# Altium project Core.PrjPcb
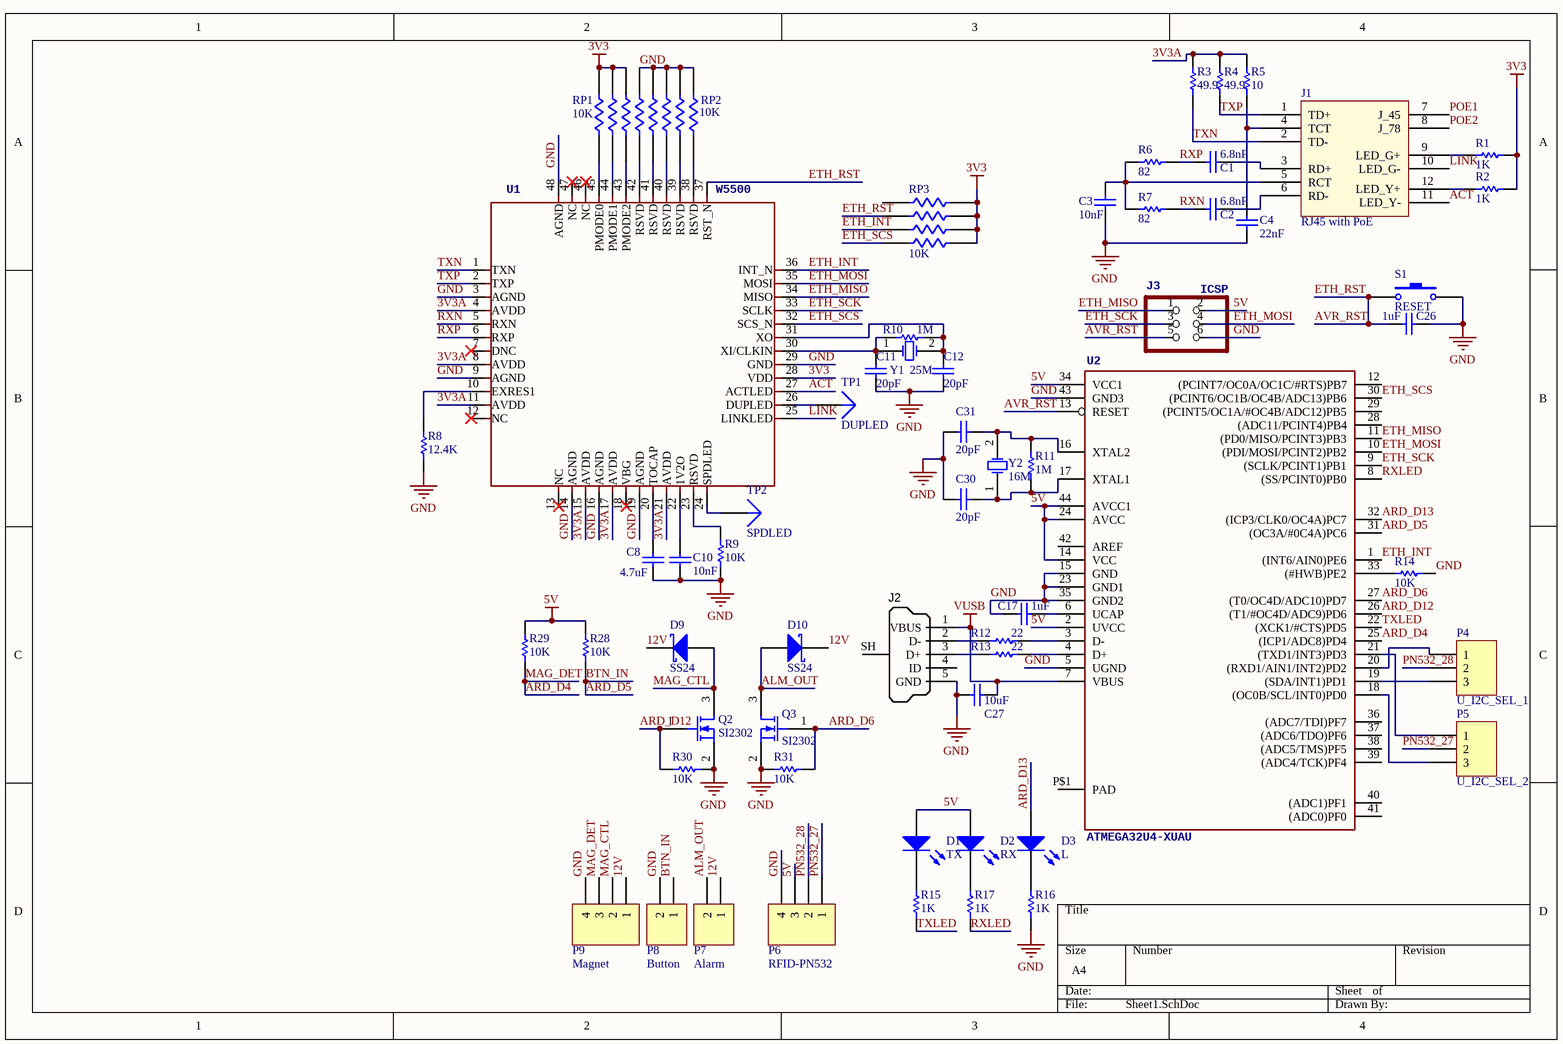
[diagram p0: Sheet1.SchDoc]
2 sheets, 112 parts. Net scope: global (net labels, ports and power ports of the same name join across sheets).
Board file: Core.PcbDoc
Sheets:
  Sheet1.SchDoc
  power.SchDoc

## Sheet Sheet1.SchDoc
size A4

### Parts
C1  value 6.8nF  [C-1608[0603]]  (hidden comment: Cap Semi)
C2  value 6.8nF  [C-1608[0603]]  (hidden comment: Cap Semi)
C3  value 10nF  [C-1608[0603]]  (hidden comment: Cap Semi)
C4  value 22nF  [C-1608[0603]]  (hidden comment: Cap Semi)
C8  value 4.7uF  [C-1608[0603]]  (hidden comment: Cap Semi)
C10  value 10nF  [C-1608[0603]]  (hidden comment: Cap Semi)
C11  value 20pF  [C-1608[0603]]  (hidden comment: Cap Semi)
C12  value 20pF  [C-1608[0603]]  (hidden comment: Cap Semi)
C17  value 1uF  [C-1608[0603]]  (hidden comment: Cap Semi)
C26  value 1uF  [C-1608[0603]]  (hidden comment: Cap Semi)
C27  value 10uF  [C-1608[0603]]  (hidden comment: Cap Semi)
C30  value 20pF  [C-1608[0603]]  (hidden comment: Cap Semi)
C31  value 20pF  [C-1608[0603]]  (hidden comment: Cap Semi)
D1  TX  [LED-1608[0603]-R]
D2  RX  [LED-1608[0603]-R]
D3  L  [LED-1608[0603]-R]
D9  SS24  [DO-214AC]
D10  SS24  [DO-214AC]
J1  RJ45 with PoE  [HR911105A]
J2  USB Micro Type B  [MICRO USB 3D]  (value not drawn)
J3  ICSP  [HDR2X3]
P4  U_I2C_SEL_1  [shortPad]
P5  U_I2C_SEL_2  [shortPad]
P6  RFID-PN532  [HDR1X4H]
P7  Alarm  [HDR1X2H]
P8  Button  [HDR1X2H]
P9  Magnet  [HDR1X4H]
Q2  SI2302  [SOT23B]
Q3  SI2302  [SOT23B]
R1  value 1K  [R-1608[0603]]  (hidden comment: Res Semi)
R2  value 1K  [R-1608[0603]]  (hidden comment: Res Semi)
R3  value 49.9  [R-1608[0603]]  (hidden comment: Res Semi)
R4  value 49.9  [R-1608[0603]]  (hidden comment: Res Semi)
R5  value 10  [R-1608[0603]]  (hidden comment: Res Semi)
R6  value 82  [R-1608[0603]]  (hidden comment: Res Semi)
R7  value 82  [R-1608[0603]]  (hidden comment: Res Semi)
R8  value 12.4K  [R-1608[0603]]  (hidden comment: Res Semi)
R9  value 10K  [R-1608[0603]]  (hidden comment: Res Semi)
R10  value 1M  [R-1608[0603]]  (hidden comment: Res Semi)
R11  value 1M  [R-1608[0603]]  (hidden comment: Res Semi)
R12  value 22  [R-1608[0603]]  (hidden comment: Res Semi)
R13  value 22  [R-1608[0603]]  (hidden comment: Res Semi)
R14  value 10K  [R-1608[0603]]  (hidden comment: Res Semi)
R15  value 1K  [R-1608[0603]]  (hidden comment: Res Semi)
R16  value 1K  [R-1608[0603]]  (hidden comment: Res Semi)
R17  value 1K  [R-1608[0603]]  (hidden comment: Res Semi)
R28  value 10K  [R-1608[0603]]  (hidden comment: Res Semi)
R29  value 10K  [R-1608[0603]]  (hidden comment: Res Semi)
R30  value 10K  [R-1608[0603]]  (hidden comment: Res Semi)
R31  value 10K  [R-1608[0603]]  (hidden comment: Res Semi)
RP1  10K  [EXB28V]
RP2  10K  [EXB28V]
RP3  10K  [EXB28V]
S1  RESET  [SW-2pin-SMD]
TP1  DUPLED  [TESTPOINT]
TP2  SPDLED  [TESTPOINT]
U1  W5500  [TQFP48_N]
U2  ATMEGA32U4-XUAU  [44A_L]
Y1  25M  [BCY-W2/D2.1]
Y2  16M  [BCY-W2/D2.1]

### Nets
3V3: R1.2 R2.2 RP1.6 RP1.7 RP1.8 RP3.1 RP3.2 RP3.3 RP3.4 U1.28(VDD)
3V3A: R3.2 R4.2 R5.2 U1.4(AVDD) U1.8(AVDD) U1.11(AVDD) U1.15(AVDD) U1.17(AVDD) U1.21(AVDD)
5V: D1.1(A) D2.1(A) J3.2 P6.3 R28.2 R29.2 U2.2(UVCC) U2.14(VCC) U2.24(AVCC) U2.34(VCC1) U2.44(AVCC1)
12V: D9.2(K) D10.2(K) P7.1 P9.1
GND: C3.2 C4.1 C8.1 C10.1 C11.1 C12.1 C17.1 C26.2 C27.2 C30.2 C31.2 J2.5(GND) J3.6 P6.4 P8.2 P9.4 Q2.2(S) Q3.2(S) R8.1 R9.1 R14.1 R16.1 R30.1 R31.2 RP1.5 RP2.5 RP2.6 RP2.7 RP2.8 S1.2 U1.3(AGND) U1.9(AGND) U1.14(AGND) U1.16(AGND) U1.19(AGND) U1.29(GND) U1.48(AGND) U2.5(UGND) U2.15(GND) U2.23(GND1) U2.35(GND2) U2.43(GND3)
VUSB: C27.1 J2.1(VBUS) U2.7(VBUS)
ACT: J1.11(LED_Y-) U1.27(ACTLED)
ALM_OUT: D10.1(A) P7.2 Q3.3(D)
ARD_D4: P9.3 R29.1 U2.25((ICP1/ADC8)PD4)  [also labelled MAG_DET]
ARD_D5: P8.1 R28.1 U2.31((OC3A/#0C4A)PC6)  [also labelled BTN_IN]
ARD_D6: Q3.1(G) R31.1 U2.27((T0/OC4D/ADC10)PD7)
ARD_D12: Q2.1(G) R30.2 U2.26((T1/#OC4D/ADC9)PD6)
ARD_D13: D3.1(A) U2.32((ICP3/CLK0/OC4A)PC7)
AVR_RST: C26.1 J3.5 RP3.6 S1.1 U1.37(RST_N) U2.13(RESET)  [also labelled ETH_RST]
ETH_INT: RP3.7 U1.36(INT_N) U2.1((INT6/AIN0)PE6)
ETH_MISO: J3.1 U1.34(MISO) U2.11((PD0/MISO/PCINT3)PB3)
ETH_MOSI: J3.4 U1.35(MOSI) U2.10((PDI/MOSI/PCINT2)PB2)
ETH_SCK: J3.3 U1.33(SCLK) U2.9((SCLK/PCINT1)PB1)
ETH_SCS: RP3.8 U1.32(SCS_N) U2.30((PCINT6/OC1B/OC4B/ADC13)PB6)
LINK: J1.10(LED_G-) U1.25(LINKLED)
MAG_CTL: D9.1(A) P9.2 Q2.3(D)
PN532_27: P5.2 P6.1
PN532_28: P4.2 P6.2
POE1: J1.7(J_45)
POE2: J1.8(J_78)
RXLED: R17.1 U2.8((SS/PCINT0)PB0)
RXN: C2.1 R7.1 U1.5(RXN)
RXP: C1.1 R6.1 U1.6(RXP)
TXLED: R15.1 U2.22((XCK1/#CTS)PD5)
TXN: J1.2(TD-) R3.1 U1.1(TXN)
TXP: J1.1(TD+) R4.1 U1.2(TXP)
NetC1_2: C1.2 J1.3(RD+)
NetC2_2: C2.2 J1.6(RD-)
NetC3_1: C3.1 J1.5(RCT) R6.2 R7.2
NetC4_2: C4.2 J1.4(TCT) R5.1
NetC8_2: C8.2 U1.20(TOCAP)
NetC10_2: C10.2 U1.22(1V2O)
NetC11_2: C11.2 R10.2 U1.30(XI/CLKIN) Y1.1(OSC1)
NetC12_2: C12.2 R10.1 U1.31(XO) Y1.2(OSC2)
NetC17_2: C17.2 U2.6(UCAP)
NetC30_1: C30.1 R11.2 U2.17(XTAL1) Y2.1(OSC1)
NetC31_1: C31.1 R11.1 U2.16(XTAL2) Y2.2(OSC2)
NetD1_2: D1.2(K) R15.2
NetD2_2: D2.2(K) R17.2
NetD3_2: D3.2(K) R16.2
NetJ1_9: J1.9(LED_G+) R1.1
NetJ1_12: J1.12(LED_Y+) R2.1
NetJ2_2: J2.2(D-) R12.2
NetJ2_3: J2.3(D+) R13.2
NetP4_1: P4.1 U2.20((RXD1/AIN1/INT2)PD2)
NetP4_3: P4.3 U2.19((SDA/INT1)PD1)
NetP5_1: P5.1 U2.21((TXD1/INT3)PD3)
NetP5_3: P5.3 U2.18((OC0B/SCL/INT0)PD0)
NetR8_2: R8.2 U1.10(EXRES1)
NetR9_2: R9.2 U1.23(RSVD)
NetR12_1: R12.1 U2.3(D-)
NetR13_1: R13.1 U2.4(D+)
NetR14_2: R14.2 U2.33((#HWB)PE2)
NetRP1_1: RP1.1 U1.45(PMODE0)
NetRP1_2: RP1.2 U1.44(PMODE1)
NetRP1_3: RP1.3 U1.43(PMODE2)
NetRP1_4: RP1.4 U1.42(RSVD)
NetRP2_1: RP2.1 U1.41(RSVD)
NetRP2_2: RP2.2 U1.40(RSVD)
NetRP2_3: RP2.3 U1.39(RSVD)
NetRP2_4: RP2.4 U1.38(RSVD)
NetTP1_1: TP1.1 U1.26(DUPLED)
NetTP2_1: TP2.1 U1.24(SPDLED)

Not connected (* = marked no-connect by the designer): J2 4(ID) SH(Shell); RP3 5; U1 7(DNC)* 12(NC)* 13(NC)* 18(VBG)* 46(NC)* 47(NC)*; U2 12((PCINT7/OC0A/OC1C/#RTS)PB7) 28((ADC11/PCINT4)PB4) 29((PCINT5/OC1A/#OC4B/ADC12)PB5) 36((ADC7/TDI)PF7) 37((ADC6/TDO)PF6) 38((ADC5/TMS)PF5) 39((ADC4/TCK)PF4) 40((ADC1)PF1) 41((ADC0)PF0) 42(AREF) P$1(PAD)

### Library data of the parts
C1-C4 C8 C10-C12 C17 C26 C27 C30 C31 = Cap Semi: Capacitor (Semiconductor SIM Model); Published: 8-Jun-2000; LatestRevisionDate: 29-May-2009; LatestRevisionNote: IPC-7351 Footprint Added.; PackageReference: C1206; Publisher: Altium Limited; PackageDescription: Chip Capacitor
D1-D3 = LED1: Typical RED GaAs LED; Published: 8-Jun-2000; LatestRevisionDate: 08-Jul-2005; LatestRevisionNote: Mech Layer 1 removed.; PackageReference: LED-1; Publisher: Altium Limited
D9 D10 = D Schottky: Schottky Diode; Published: 8-Jun-2000; LatestRevisionDate: 17-Jul-2002; LatestRevisionNote: Re-released for DXP Platform.; PackageReference: SMB; Publisher: Altium Limited; Code_JEDEC: DO-214-AA
J1 = HLJ-6115ANL
J2 = USB_Micro_TypeB: Connector SMD USB Micro Type B middle mount; Manufacturer 1: Molex Inc; Manufacturer Part Number 1: 47491-0001; SCDType: undef; Package / Case: SMD; Supplier 1: Digi-Key; Supplier Part Number 1: WM17142CT-ND
J3 = PINHD-2X3
P4 P5 = Header 3: Header, 3-Pin; LatestRevisionDate: 17-Jul-2002; LatestRevisionNote: Re-released for DXP Platform.; Publisher: Altium Limited
P6 P9 = Header 4H: Header, 4-Pin, Right Angle; LatestRevisionDate: 17-Jul-2002; LatestRevisionNote: Re-released for DXP Platform.; Publisher: Altium Limited
P7 P8 = Header 2H: Header, 2-Pin, Right Angle; LatestRevisionDate: 17-Jul-2002; LatestRevisionNote: Re-released for DXP Platform.; Publisher: Altium Limited
Q2 Q3 = SI2302: N-Channel MOSFET; Published: 8-Jun-2000; LatestRevisionDate: 17-Jul-2002; LatestRevisionNote: Re-released for DXP Platform.; PackageVersion: 1995/1996; PackageReference: E3; Publisher: Altium Limited
R1-R17 R28-R31 = Res Semi: Semiconductor Resistor; Published: 8-Jun-2000; LatestRevisionDate: 17-Jul-2002; LatestRevisionNote: Re-released for DXP Platform.; PackageReference: AXIAL-0.5; Publisher: Altium Limited
RP1-RP3 = RPACK4
S1 = SW-PB: Switch; Published: 24-Mar-1999; LatestRevisionDate: 17-Jul-2002; LatestRevisionNote: Re-released for DXP Platform.; PackageReference: SPST-2; Publisher: Altium Limited
TP1 TP2 = Plug: LatestRevisionDate: 17-Jul-2002; LatestRevisionNote: Re-released for DXP Platform.; Publisher: Altium Limited
U1 = DRIVER-W5500
Y1 Y2 = XTAL: Crystal Oscillator; Published: 8-Jun-2000; LatestRevisionDate: 17-Jul-2002; LatestRevisionNote: Re-released for DXP Platform.; PackageReference: R38; Publisher: Altium Limited

## Sheet power.SchDoc
size A4
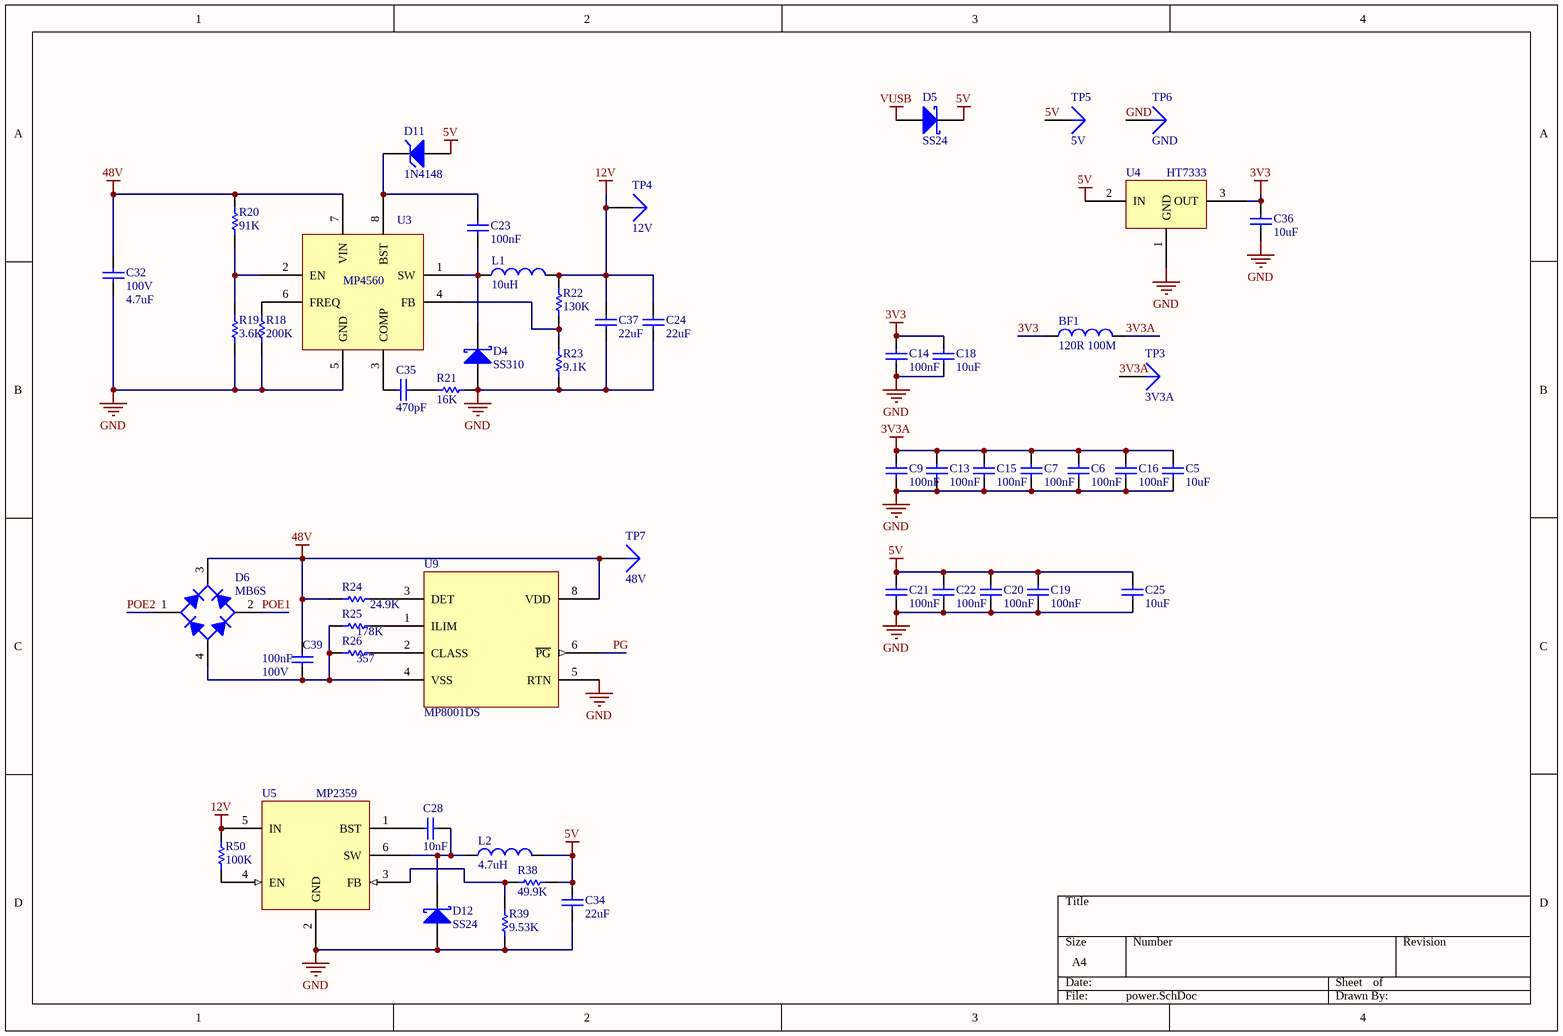
[diagram p1: power.SchDoc]

### Parts
BF1  value 120R 100M  [L-1608[0603]]  (hidden comment: GZ1608D121TF)
C5  value 10uF  [C-1608[0603]]  (hidden comment: Cap Semi)
C6  value 100nF  [C-1608[0603]]  (hidden comment: Cap Semi)
C7  value 100nF  [C-1608[0603]]  (hidden comment: Cap Semi)
C9  value 100nF  [C-1608[0603]]  (hidden comment: Cap Semi)
C13  value 100nF  [C-1608[0603]]  (hidden comment: Cap Semi)
C14  value 100nF  [C-1608[0603]]  (hidden comment: Cap Semi)
C15  value 100nF  [C-1608[0603]]  (hidden comment: Cap Semi)
C16  value 100nF  [C-1608[0603]]  (hidden comment: Cap Semi)
C18  value 10uF  [C-1608[0603]]  (hidden comment: Cap Semi)
C19  value 100nF  [C-1608[0603]]  (hidden comment: Cap Semi)
C20  value 100nF  [C-1608[0603]]  (hidden comment: Cap Semi)
C21  value 100nF  [C-1608[0603]]  (hidden comment: Cap Semi)
C22  value 100nF  [C-1608[0603]]  (hidden comment: Cap Semi)
C23  value 100nF  [C-1608[0603]]  (hidden comment: Cap Semi)
C24  value 22uF  [CAPC3225L]  (hidden comment: Cap Semi)
C25  value 10uF  [C-1608[0603]]  (hidden comment: Cap Semi)
C28  value 10nF  [C-1608[0603]]  (hidden comment: Cap Semi)
C32  100V  value 4.7uF  [CAPC3216L]
C34  value 22uF  [CAPC2512L]  (hidden comment: Tantalum)
C35  value 470pF  [C-1608[0603]]  (hidden comment: Cap Semi)
C36  value 10uF  [CAPC2512L]  (hidden comment: Tantalum)
C37  value 22uF  [CAPC3225L]  (hidden comment: Cap Semi)
C39  100V  value 100nF  [C-2012[0805]]
D4  SS310  [DO-214AC]
D5  SS24  [DO-214AC]
D6  MB6S  [MB6S]
D11  1N4148  [LL-34]
D12  SS24  [DO-214AC]
L1  value 10uH  [L-5040]  (hidden comment: Inductor)
L2  value 4.7uH  [INDC4532N]  (hidden comment: Inductor)
R18  value 200K  [R-1608[0603]]  (hidden comment: Res Semi)
R19  value 3.6K  [R-1608[0603]]  (hidden comment: Res Semi)
R20  value 91K  [R-1608[0603]]  (hidden comment: Res Semi)
R21  value 16K  [R-1608[0603]]  (hidden comment: Res Semi)
R22  value 130K  [R-1608[0603]]  (hidden comment: Res Semi)
R23  value 9.1K  [R-1608[0603]]  (hidden comment: Res Semi)
R24  value 24.9K  [R-2012[0805]]  (hidden comment: 1/4W)
R25  value 178K  [R-1608[0603]]  (hidden comment: Res Semi)
R26  value 357  [R-1608[0603]]  (hidden comment: Res Semi)
R38  value 49.9K  [R-1608[0603]]  (hidden comment: Res Semi)
R39  value 9.53K  [R-1608[0603]]  (hidden comment: Res Semi)
R50  value 100K  [R-1608[0603]]  (hidden comment: Res Semi)
TP3  3V3A  [TESTPOINT]
TP4  12V  [TESTPOINT]
TP5  5V  [TESTPOINT]
TP6  GND  [TESTPOINT]
TP7  48V  [TESTPOINT]
U3  MP4560  [MP1584]  (value not drawn)
U4  HT7333  [SOT89]
U5  MP2359  [SOT23-6]
U9  MP8001DS  [SOIC_E150_8]

### Nets
3V3: BF1.1 C14.2 C18.2 C36.1 U4.3(OUT)
3V3A: BF1.2 C5.2 C6.2 C7.2 C9.2 C13.2 C15.2 C16.2 TP3.1
5V: C19.2 C20.2 C21.2 C22.2 C25.2 C34.1 D5.2(K) D11.1(A) L2.2 R38.1 TP5.1 U4.2(IN)
12V: C24.1 C37.1 L1.2 R22.2 R50.1 TP4.1 U5.5(IN)
48V: C32.2 C39.2 D6.3(K) R20.2 R24.2 TP7.1 U3.7(VIN) U9.8(VDD)
GND: C5.1 C6.1 C7.1 C9.1 C13.1 C14.1 C15.1 C16.1 C18.1 C19.1 C20.1 C21.1 C22.1 C24.2 C25.1 C32.1 C34.2 C36.2 C37.2 D4.1(A) D12.1(A) R18.1 R19.1 R21.1 R23.1 R39.1 TP6.1 U3.5(GND) U4.1(GND) U5.2(GND) U9.5(RTN)
VUSB: D5.1(A)
PG: U9.6(~{PG})
POE1: D6.2(C)
POE2: D6.1(C)
NetC23_1: C23.1 D4.2(K) L1.1 U3.1(SW)
NetC23_2: C23.2 D11.2(K) U3.8(BST)
NetC28_1: C28.1 U5.1(BST)
NetC28_2: C28.2 D12.2(K) L2.1 U5.6(SW)
NetC35_1: C35.1 U3.3(COMP)
NetC35_2: C35.2 R21.2
NetC39_1: C39.1 D6.4(A) R25.2 R26.2 U9.4(VSS)
NetR18_2: R18.2 U3.6(FREQ)
NetR19_2: R19.2 R20.1 U3.2(EN)
NetR22_1: R22.1 R23.2 U3.4(FB)
NetR24_1: R24.1 U9.3(DET)
NetR25_1: R25.1 U9.1(ILIM)
NetR26_1: R26.1 U9.2(CLASS)
NetR38_2: R38.2 R39.2 U5.3(FB)
NetR50_2: R50.2 U5.4(EN)

### Library data of the parts
BF1 L1 L2 = Inductor: Code_IEC: 1005; Published: 8-Jun-2000; LatestRevisionDate: 29-May-2009; LatestRevisionNote: IPC-7351 Footprint Added.; PackageReference: 0402-A; Publisher: Altium Limited; PackageDescription: Chip Inductor; Code_JEITA: 0402
C5-C7 C9 C13-C16 C18-C25 C28 C32 C34-C37 C39 = Cap Semi: Capacitor (Semiconductor SIM Model); Published: 8-Jun-2000; LatestRevisionDate: 29-May-2009; LatestRevisionNote: IPC-7351 Footprint Added.; PackageReference: C1206; Publisher: Altium Limited; PackageDescription: Chip Capacitor
D4 D5 D12 = D Schottky: Schottky Diode; Published: 8-Jun-2000; LatestRevisionDate: 17-Jul-2002; LatestRevisionNote: Re-released for DXP Platform.; PackageReference: SMB; Publisher: Altium Limited; Code_JEDEC: DO-214-AA
D6 = Bridge1: Full Wave Diode Bridge; Published: 8-Jun-2000; LatestRevisionDate: 29-May-2009; LatestRevisionNote: Sch pins A & K swapped.; DatasheetVersion: E2732B; PackageReference: D-38; Publisher: Altium Limited
D11 = D Zener: Zener Diode; Published: 8-Jun-2000; LatestRevisionDate: 17-Jul-2002; LatestRevisionNote: Re-released for DXP Platform.; PackageReference: DIODE-0.7; Publisher: Altium Limited
R18-R26 R38 R39 R50 = Res Semi: Semiconductor Resistor; Published: 8-Jun-2000; LatestRevisionDate: 17-Jul-2002; LatestRevisionNote: Re-released for DXP Platform.; PackageReference: AXIAL-0.5; Publisher: Altium Limited
TP3-TP7 = Plug: LatestRevisionDate: 17-Jul-2002; LatestRevisionNote: Re-released for DXP Platform.; Publisher: Altium Limited
U3 = MP4560: 2A, 2MHz, 55V Step-Down Converter
U4 = HT73XX: Low Power Consumption LDO
U5 = MP2359: 1.2A, 24V, 1.4MHz  Step-Down Converter
U9 = MP8001

## Nets that join several sheets
3V3: Sheet1 (10 pins), power (5 pins)
3V3A: Sheet1 (9 pins), power (9 pins)
5V: Sheet1 (11 pins), power (12 pins)
12V: Sheet1 (D9.2 D10.2 P7.1 P9.1), power (7 pins)
GND: Sheet1 (42 pins), power (31 pins)
VUSB: Sheet1 (C27.1 J2.1 U2.7), power (D5.1)
POE1: Sheet1 (J1.7), power (D6.2)
POE2: Sheet1 (J1.8), power (D6.1)